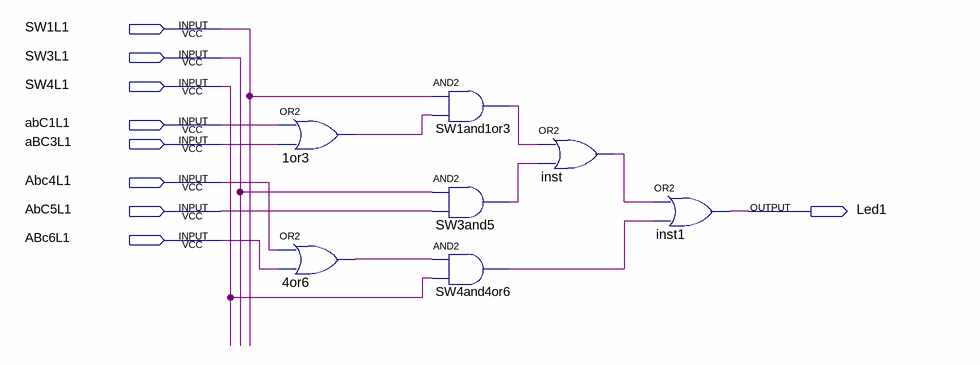
[diagram p0: schematic sheet]
// Quartus schematic Led1.bdf as structural Verilog: 7 symbols, 9 pins
module Led1 (
  input  SW1L1,
  input  SW3L1,
  input  SW4L1,
  input  abC1L1,
  input  aBC3L1,
  input  Abc4L1,
  input  AbC5L1,
  input  ABc6L1,
  output Led1
);

  wire inst_out, n1or3_out, n4or6_out, SW1and1or3_out, SW3and5_out, SW4and4or6_out;

  or u_1or3 (n1or3_out, abC1L1, aBC3L1);
  or u_4or6 (n4or6_out, Abc4L1, ABc6L1);
  and SW1and1or3 (SW1and1or3_out, SW1L1, n1or3_out);
  and SW3and5 (SW3and5_out, SW3L1, AbC5L1);
  and SW4and4or6 (SW4and4or6_out, n4or6_out, SW4L1);
  or inst (inst_out, SW1and1or3_out, SW3and5_out);
  or inst1 (Led1, inst_out, SW4and4or6_out);
endmodule
